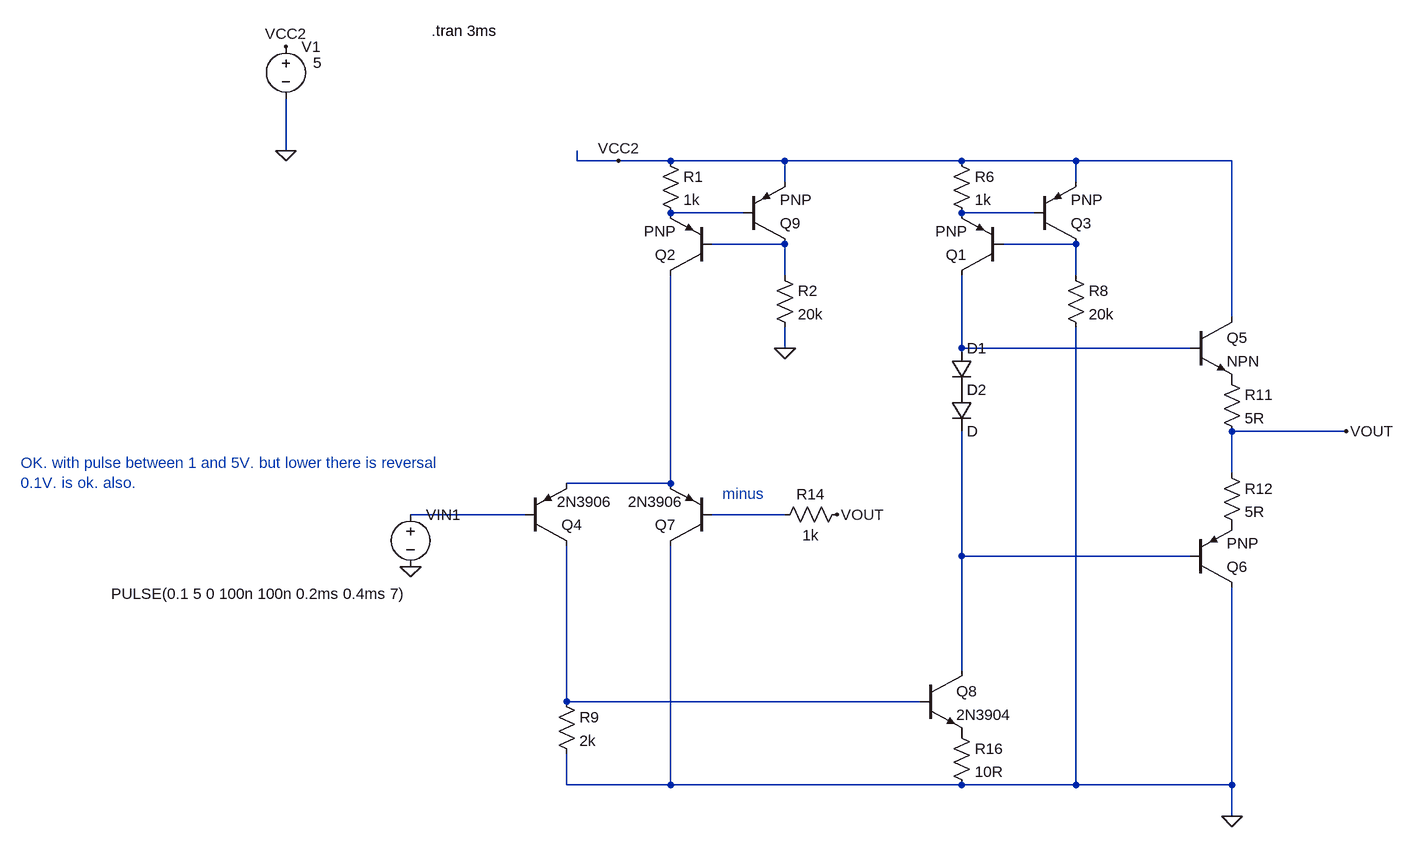
[diagram p0: schematic Draft45.asc]
Draft45.asc, the LTspice schematic file:
Version 4
SHEET 1 1508 952
WIRE -336 -208 -336 -288
WIRE 112 -192 112 -208
WIRE 176 -192 112 -192
WIRE 256 -192 176 -192
WIRE 432 -192 256 -192
WIRE 704 -192 432 -192
WIRE 880 -192 704 -192
WIRE 1120 -192 880 -192
WIRE 432 -160 432 -192
WIRE 880 -160 880 -192
WIRE 368 -112 256 -112
WIRE 816 -112 704 -112
WIRE 432 -64 320 -64
WIRE 880 -64 768 -64
WIRE 432 -16 432 -64
WIRE 880 -16 880 -64
WIRE 1120 48 1120 -192
WIRE 432 96 432 64
WIRE 704 96 704 -16
WIRE 1056 96 704 96
WIRE 1296 224 1120 224
WIRE 1120 288 1120 224
WIRE 256 304 256 -16
WIRE 256 304 96 304
WIRE 32 352 -144 352
WIRE 432 352 320 352
WIRE 704 416 704 224
WIRE 1056 416 704 416
WIRE 704 592 704 416
WIRE 96 640 96 400
WIRE 640 640 96 640
WIRE 96 768 96 720
WIRE 256 768 256 400
WIRE 256 768 96 768
WIRE 704 768 256 768
WIRE 880 768 880 64
WIRE 880 768 704 768
WIRE 1120 768 1120 464
WIRE 1120 768 880 768
WIRE 1120 816 1120 768
FLAG -336 -368 VCC2
FLAG 1296 224 VOUT
FLAG -144 432 0
FLAG 176 -192 VCC2
FLAG 512 352 VOUT
FLAG 432 96 0
FLAG 1120 816 0
FLAG -336 -208 0
SYMBOL pnp 768 -16 R180
SYMATTR InstName Q1
SYMBOL pnp 816 -64 M180
SYMATTR InstName Q3
SYMBOL res 688 -208 R0
SYMATTR InstName R6
SYMATTR Value 1k
SYMBOL voltage -336 -384 R0
WINDOW 123 0 0 Left 0
WINDOW 39 0 0 Left 0
WINDOW 3 42 41 Left 2
SYMATTR Value 5
SYMATTR InstName V1
SYMBOL res 864 -32 R0
SYMATTR InstName R8
SYMATTR Value 20k
SYMBOL npn 1056 48 R0
SYMATTR InstName Q5
SYMBOL res 1104 128 R0
SYMATTR InstName R11
SYMATTR Value 5R
SYMBOL res 1104 272 R0
SYMATTR InstName R12
SYMATTR Value 5R
SYMBOL pnp 1056 464 M180
SYMATTR InstName Q6
SYMBOL voltage -144 336 R0
WINDOW 123 0 0 Left 0
WINDOW 39 0 0 Left 0
WINDOW 3 -461 138 Left 2
SYMATTR Value PULSE(0.1 5 0 100n 100n 0.2ms 0.4ms 7)
SYMATTR InstName VIN1
SYMBOL res 80 624 R0
SYMATTR InstName R9
SYMATTR Value 2k
SYMBOL res 528 336 R90
WINDOW 0 0 56 VBottom 2
WINDOW 3 32 56 VTop 2
SYMATTR InstName R14
SYMATTR Value 1k
SYMBOL res 688 672 R0
SYMATTR InstName R16
SYMATTR Value 10R
SYMBOL pnp 32 400 M180
WINDOW 3 49 68 Left 2
SYMATTR InstName Q4
SYMATTR Value 2N3906
SYMBOL pnp 320 400 R180
WINDOW 3 45 68 Left 2
SYMATTR InstName Q7
SYMATTR Value 2N3906
SYMBOL npn 640 592 R0
SYMATTR InstName Q8
SYMATTR Value 2N3904
SYMBOL pnp 320 -16 R180
SYMATTR InstName Q2
SYMBOL pnp 368 -64 M180
SYMATTR InstName Q9
SYMBOL res 240 -208 R0
SYMATTR InstName R1
SYMATTR Value 1k
SYMBOL res 416 -32 R0
SYMATTR InstName R2
SYMATTR Value 20k
SYMBOL diode 688 96 R0
SYMATTR InstName D1
SYMBOL diode 688 160 R0
SYMATTR InstName D2
TEXT -112 -392 Left 2 !.tran 3ms
TEXT 336 320 Left 2 ;minus
TEXT -744 272 Left 2 ;OK. with pulse between 1 and 5V. but lower there is reversal\n0.1V. is ok. also.

The netlist it stands for:
* Draft45.asc
Q1 N005 N004 N002 0 PNP
Q3 N004 N002 VCC2 0 PNP
R6 VCC2 N002 1k
V1 VCC2 0 5
R8 N004 0 20k
Q5 VCC2 N005 P001 0 NPN
R11 P001 VOUT 5R
R12 VOUT P002 5R
Q6 0 N009 P002 0 PNP
VIN1 N007 0 PULSE(0.1 5 0 100n 100n 0.2ms 0.4ms 7)
R9 N010 0 2k
R14 VOUT N008 1k
R16 P003 0 10R
Q4 N010 N007 N006 0 2N3906
Q7 0 N008 N006 0 2N3906
Q8 N009 N010 P003 0 2N3904
Q2 N006 N003 N001 0 PNP
Q9 N003 N001 VCC2 0 PNP
R1 VCC2 N001 1k
R2 N003 0 20k
D1 N005 P004 D
D2 P004 N009 D
.model D D
.lib standard.dio
.model NPN NPN
.model PNP PNP
.lib standard.bjt
.tran 3ms
* minus
* OK. with pulse between 1 and 5V. but lower there is reversal
* 0.1V. is ok. also.
.backanno
.end